# EAGLE design TinyISD1700_V2_2020-08-19-smd-sop-1206 (EAGLE 7.5.0)
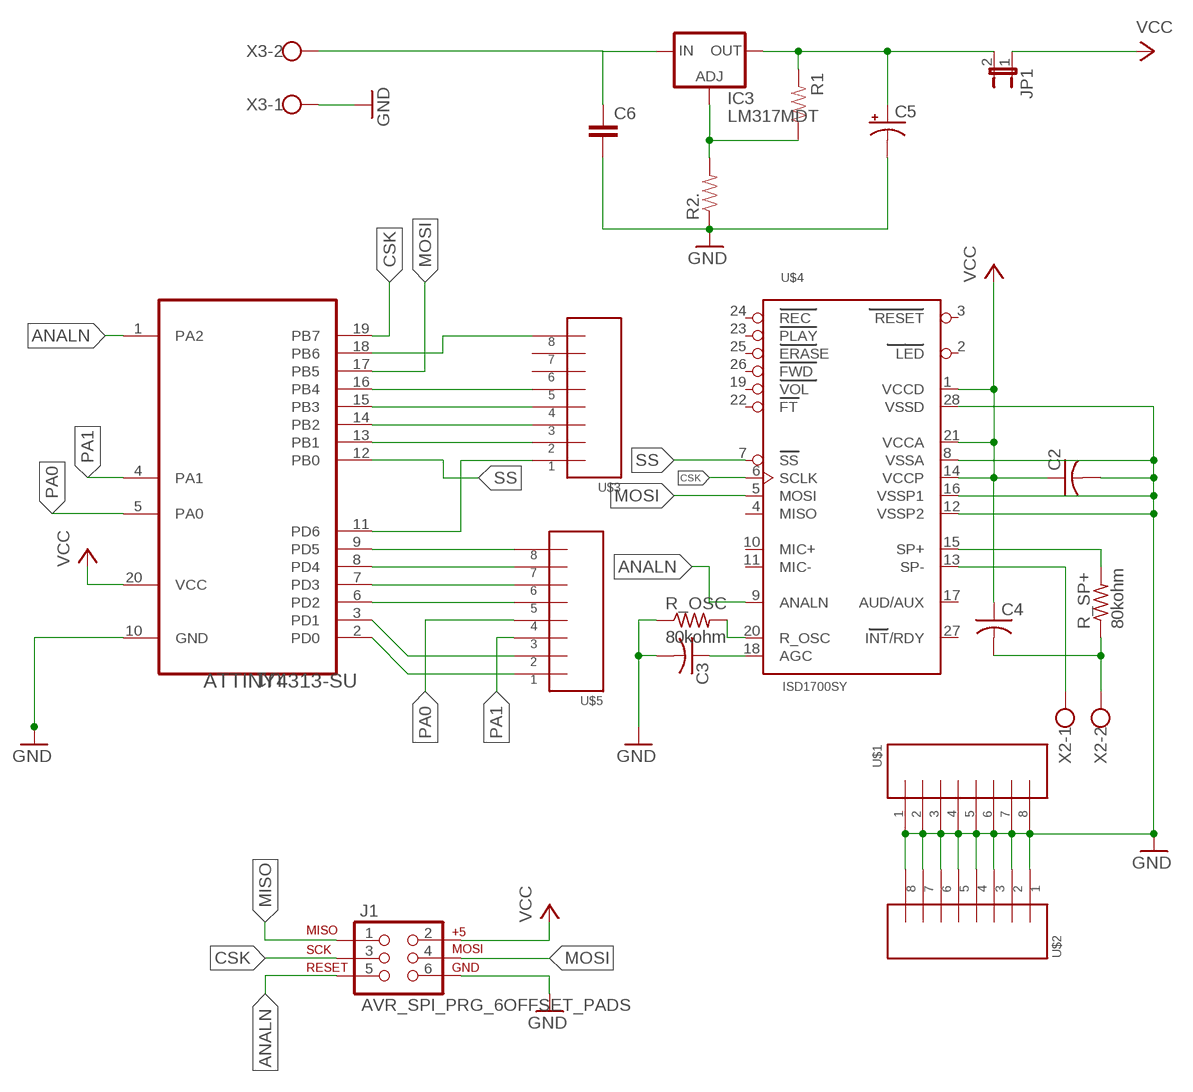
[diagram p0: schematic, sheet 1]

## Parts
C2  C-US050-030X075  [C050-030X075]
C3  C-US050-030X075  [C050-030X075]
C4  C-US050-030X075  [C050-030X075]
C5  CAP_POL1206  [EIA3216]
C6  CAP0805  [0805]
IC3  LM317MDT  [DPACK]
J1  AVR_SPI_PRG_6OFFSET_PADS  [2X3_OFFSET]
JP1  JP1E  [JP1]
R1  RESISTOR  [0805]
R2.  RESISTOR  [0805]
R_OSC  80kohm  R-US_0204/2V  [0204V]
R_SP+  80kohm  R-US_0204/2V  [0204V]
U1  ATTINY4313-SU  [SOIC127P1032X265-20N]
U$1  8PIN_HEADER  [8PIN_HEADER]
U$2  8PIN_HEADER  [8PIN_HEADER]
U$3  8PIN_HEADER  [8PIN_HEADER]
U$4  ISD1700SY  [SO28W]
U$5  8PIN_HEADER  [8PIN_HEADER]
X2  W237-102  [W237-102]
X3  W237-102  [W237-102]

## Nets
ANALN: J1.5 U1.1(PA2) U$4.9(ANALN)
CSK: J1.3 U1.19(PB7) U$4.6(SCLK)
GND: C2.2 C3.2 C5.C(-) C6.2 J1.6 R2..1 R_OSC.1 U1.10(GND) U$1.P$1 U$1.P$2 U$1.P$3 U$1.P$4 U$1.P$5 U$1.P$6 U$1.P$7 U$1.P$8 U$2.P$1 U$2.P$2 U$2.P$3 U$2.P$4 U$2.P$5 U$2.P$6 U$2.P$7 U$2.P$8 U$4.8(VSSA) U$4.12(VSSP2) U$4.16(VSSP1) U$4.28(VSSD) X3.1
MISO: J1.1
MOSI: J1.4 U1.17(PB5) U$4.5(MOSI)
N$1: R_OSC.2 U$4.20(R_OSC)
N$2: U1.13(PB1) U$3.P$2
N$3: U1.14(PB2) U$3.P$3
N$4: C4.2 R_SP+.1 X2.2
N$5: C3.1 U$4.18(AGC)
N$6: U$4.13(SP-) X2.1
N$7: R_SP+.2 U$4.15(SP+)
N$8: U1.15(PB3) U$3.P$4
N$9: U1.11(PD6) U$3.P$1
N$11: U1.9(PD5) U$5.P$8
N$12: U1.8(PD4) U$5.P$7
N$13: U1.7(PD3) U$5.P$6
N$14: U1.6(PD2) U$5.P$5
N$15: U1.3(PD1) U$5.P$2
N$16: U1.2(PD0) U$5.P$1
N$19: C5.A(+) IC3.4(OUT) JP1.2 R1.2
N$20: U1.16(PB4) U$3.P$5
N$28: C6.1 IC3.3(IN) X3.2
N$29: IC3.1(ADJ) R1.1 R2..2
PA0: U1.5(PA0) U$5.P$4
PA1: U1.4(PA1) U$5.P$3
Q: U1.18(PB6) U$3.P$8
SS: U1.12(PB0) U$4.7(SS)
VCC: C2.1 C4.1 J1.2 JP1.1 U1.20(VCC) U$4.1(VCCD) U$4.14(VCCP) U$4.21(VCCA)
Unconnected: U$3.P$6 U$3.P$7 U$4.2(LED) U$4.3(RESET) U$4.4(MISO) U$4.10(MIC+) U$4.11(MIC-) U$4.17(AUD/AUX) U$4.19(VOL) U$4.22(FT) U$4.23(PLAY) U$4.24(REC) U$4.25(ERASE) U$4.26(FWD) U$4.27(INT/RDY)

## Library data of the parts
C2-C4 = resistor:C-US: CAPACITOR, American symbol; OC_FARNELL: unknown
C5 = SparkFun2:CAP_POL: Capacitor Polarized These are standard SMD and PTH capacitors. Normally 10uF, 47uF, and 100uF in electrolytic and tantalum varieties. Always verify the external diameter of the through hole cap, it varies with capacity, voltage, and manufacturer. The EIA devices should be standard.
C6 = SparkFun2:CAP: Capacitor Standard 0603 ceramic capacitor, and 0.1" leaded capacitor.
IC3 = v-reg:LM317?*: 500 mA Adjustable Output Positive Voltage Regulator Source: http://www.onsemi.co.jp .. LM317M-D.PDF
J1 = SparkFun:AVR_SPI_PRG_6: AVR ISP 6 Pin This is the reduced ISP connector for AVR programming. Common on Arduino. This footprint will take up less PCB space and can be used with a 10-pin to 6-pin adapter such as SKU: BOB-08508; OC_FARNELL: unknown
JP1 = jumper:JP1E: JUMPER
R1 R2. = SparkFun:RESISTOR: Resistor Basic schematic elements and footprints for 0603, 1206, and PTH 1/10th watt (small) resistors.
R_OSC R_SP+ = rcl:R-US_: RESISTOR, American symbol; OC_FARNELL: unknown
U1 = Atmel_By_element14_Batch_1-00:ATTINY4313-SU: 8-bit Microcontroller with In-System Programmable Flash; MF: MICROCHIP; MPN: ATTINY4313-SU; OC_FARNELL: 1841621; OC_NEWARK: 12T1340; PACKAGE: SOIC-20; SUPPLIER: Atmel
U$1-U$3 U$5 = arduino:8PIN_HEADER; MF: RENESAS; MPN: YSDKS128E10; OC_FARNELL: 2946736
U$4 = isd-new-1:ISD1700; OC_FARNELL: unknown
X2 X3 = con-wago-500:W237-102: WAGO SCREW CLAMP; OC_FARNELL: unknown; OC_NEWARK: 70K9898

## Board
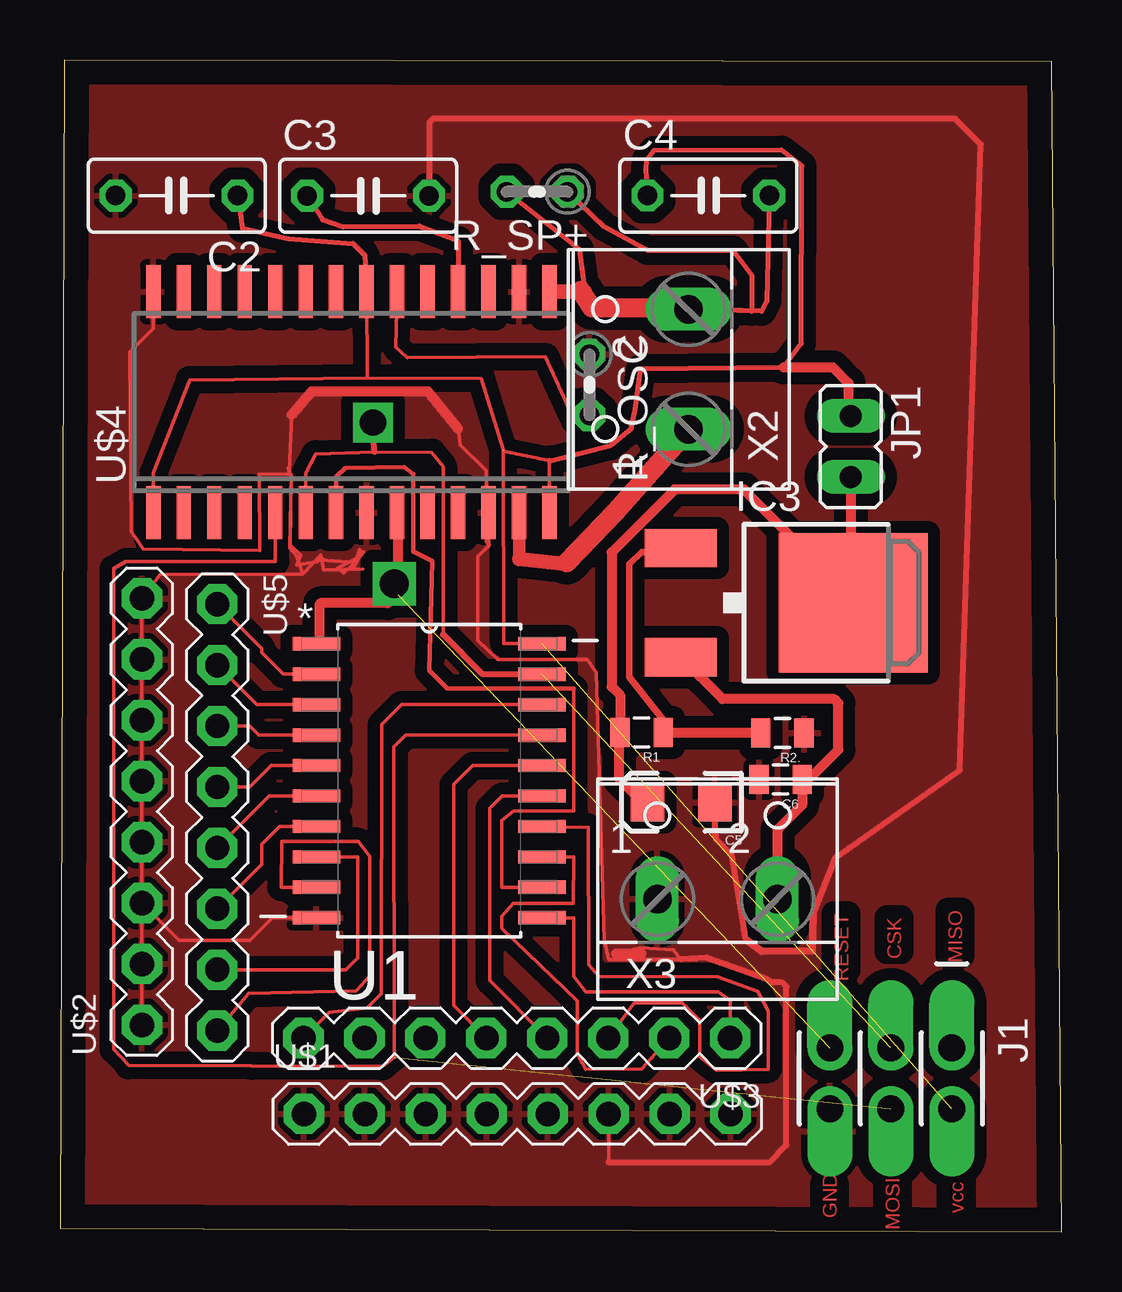
[diagram p1: board, top side]

Size 41.73 x 48.85 mm. Coordinates in mm from the lower left corner, seen from the top.
Outline: 0,0.15 41.73,0 41.33,48.79 0.18,48.85 0,0.15
Copper layers (1*16): Top 0.035mm / dielectric 1.5mm / Bottom 0.035mm
Design rules "default *": minimum track width 10mil, minimum drill 24mil, track to track 20mil, track to pad 20mil, pad to pad 20mil, via to via 20mil, smd to smd 8mil, copper to edge 40mil, drill to drill 8mil, minimum pad ring 10mil, minimum via ring 8mil, stop-mask expansion 4mil, vias tented up to drill 0mil, thermal gap 10mil

### Footprints (pad centres in the part's own frame; a part is rotated, then mirrored left to right if it is on the bottom)
C050-030X075 = drill 0.813 octagon: 1 -2.54,0; 2 2.54,0
EIA3216 = smd 1.4 x 1.6: A 1.4,0; C -1.4,0
0805 = smd 0.8 x 1.2: 1 -0.9,0; 2 0.9,0
DPACK = smd 1.6 x 3: 1 -2.28,-4.8; 3 2.28,-4.8 | smd 5.8 x 6.2: 4 0,2.38
2X3_OFFSET = drill 1.118 pad 1.88 offset: 1 -2.54,-1.27; 2 -2.54,1.27; 3 0,-1.27; 4 0,1.27; 5 2.54,-1.27; 6 2.54,1.27
JP1 = drill 0.914 long: 1 0,-1.27; 2 0,1.27
0204V = drill 0.813 octagon: 1 -1.27,0; 2 1.27,0
SOIC127P1032X265-20N = smd 1.981 x 0.559: 1 -4.699,5.715; 2 -4.699,4.445; 3 -4.699,3.175; 4 -4.699,1.905; 5 -4.699,0.635; 6 -4.699,-0.635; 7 -4.699,-1.905; 8 -4.699,-3.175; 9 -4.699,-4.445; 10 -4.699,-5.715; 11 4.699,-5.715; 12 4.699,-4.445; 13 4.699,-3.175; 14 4.699,-1.905; 15 4.699,-0.635; 16 4.699,0.635; 17 4.699,1.905; 18 4.699,3.175; 19 4.699,4.445; 20 4.699,5.715
8PIN_HEADER = drill 1.016 pad 1.676 octagon: P$1 0,0; P$2 2.54,0; P$3 5.08,0; P$4 7.62,0; P$5 10.16,0; P$6 12.7,0; P$7 15.24,0; P$8 17.78,0
SO28W = smd 0.6 x 2.2: 1 -8.255,-4.6; 2 -6.985,-4.6; 3 -5.715,-4.6; 4 -4.445,-4.6; 5 -3.175,-4.6; 6 -1.905,-4.6; 7 -0.635,-4.6; 8 0.635,-4.6; 9 1.905,-4.6; 10 3.175,-4.6; 11 4.445,-4.6; 12 5.715,-4.6; 13 6.985,-4.6; 14 8.255,-4.6; 15 8.255,4.6; 16 6.985,4.6; 17 5.715,4.6; 18 4.445,4.6; 19 3.175,4.6; 20 1.905,4.6; 21 0.635,4.6; 22 -0.635,4.6; 23 -1.905,4.6; 24 -3.175,4.6; 25 -4.445,4.6; 26 -5.715,4.6; 27 -6.985,4.6; 28 -8.255,4.6
W237-102 = drill 1.194 long: 1 -2.5,-1.27; 2 2.5,-1.27

### Placement (x,y rotation side)
C2  4.86,43.2 180 top
C3  12.84,43.2 0 top
C4  27.01,43.2 0 top
C5  25.88,17.91 180 top
C6  30.03,18.86 180 top
IC3  30.67,26.23 270 top
J1  34.62,6.4 180 top
JP1  32.95,32.74 180 top
R1  24.23,20.82 180 top
R2.  30.1,20.8 180 top
R_OSC  22.06,35.31 270 top
R_SP+  19.88,43.36 180 top
U1  15.38,18.81 0 top
U$1  10.16,4.92 0 top
U$2  3.41,8.63 90 top
U$3  27.92,8.08 180 top
U$4  12.14,34.59 0 top
U$5  6.55,26.17 270 top
X2  24.92,35.96 90 top
X3  27.39,15.15 0 top

### Tracks (layer width: path | path; a pad name or v marks a point on that pad's centre or on a via)
ANALN  (1 unrouted)
  Top 0.406: U$4.9 14.07,29.92 14.07,26.58 13.64,26.21 10.85,26.21 10.83,26.19 10.83,24.52 U1.1
CSK  (1 unrouted)
  Top 0.152: U$4.6 10.24,31.63 10.65,32.43 13.1,32.52 15.49,32.49 15.96,31.91 15.96,24.9
  Top 0.254: 15.96,24.9 17.59,23.27 20.07,23.27 U1.19 | 13.1,32.52 13.05,33.67
GND
  Top 0.152: U$4.28 3.89,37.65 2.9,36.66 2.96,29.19 3.46,28.46 8.33,28.4 8.3,31.6 9.63,31.56 9.58,28.5 9.86,28.18 10.12,27.42 | U$2.P$3 4.97,12.15 7.9,12.15 8.85,13.09 U1.10 | 23.17,11.6 24.23,11.84 25.56,11.77 25.87,11.37 22.87,11.37 22.68,12.16 22.34,23.32 21.97,23.86 18.23,23.86 17.4,24.65 17.4,28.15 17.86,28.6 U$4.12 | 12.61,27.64 11,27.59 10.86,28.22 10.12,27.42 | U$2.P$3 U$2.P$2 U$2.P$1 | U$2.P$3 U$2.P$4 U$2.P$5 U$2.P$6 U$2.P$7 U$2.P$8 4.18,27.39 10.12,27.42
  Top 0.154: 17.4,28.15 17.88,28.62 17.88,28.66 17.75,28.78 17.75,31.73 16.68,32.8 16.59,33.48 | 9.65,34.07 9.55,31.69 9.53,31.69 9.51,31.87 9.63,31.48 9.6,28.64 10.02,28.21 9.86,27.79 10.74,27.94 10.64,27.95 | 10.7,27.99 10.99,28.03 10.83,28.02 12.3,27.89 11.82,27.46 11.57,27.67 12.38,28.1 12.57,28.29 12.3,27.91 12.66,28.34 | 12.66,28.34 12.55,28.36 12.49,28.38 12.51,28.2 12.22,27.68 | 12.53,28.24 12.66,28.34 | 12.49,28.45 12.25,27.79 | U$1.P$6 22.86,2.92 22.85,2.91
  Top 0.254: C5.C 27.28,16.57 27.33,16.53 27.33,16.39 27.97,15.75 28.48,12.61 28.54,12.3 28.66,12.13 | 31.39,13.23 32.33,15.62 37.5,19.26 38.37,45.33 37.29,46.41 15.56,46.41 15.39,46.24 C3.2 | 22.85,2.91 29.55,2.91 30.27,3.63 30.27,10.22 30.1,10.39 29.7,10.39 29.48,10.53 26.92,11.43 25.87,11.37
  Top 0.305: 28.66,12.13 29.24,11.69 31.35,11.72 31.39,13.23
  Top 0.406: 23.17,11.6 24.24,11.6 | 16.59,33.48 15.33,35.03 10.47,35.04 9.65,34.07
  pour Top: 0.35,48.58 40.76,48.75 40.88,-0.09 0.15,0.4 0.32,7.24
MOSI  (1 unrouted)
  Top 0.152: U1.17 14.4,20.71 13.9,20.21 13.92,7.28 13.44,6.9 7.97,6.92 2.86,6.95 2.24,7.61 2.24,27.65 2.75,27.94 8.98,27.94 U$4.5
  Top 0.406: J1.4 34.63,5.13
N$1
  Top 0.152: 13.99,36.89 U$4.20
  Top 0.154: R_OSC.2 21.33,34.07 20.22,36.48 14.46,36.45 13.99,36.89
N$2
  Top 0.152: U$3.P$2 24.23,6.8 21.92,6.78 21.55,7.43 21.55,9.64 18.4,12.65 18.4,13.15 18.89,13.7 21.39,13.7 21.4,15.63 U1.13
N$3
  Top 0.152: U$3.P$3 23.93,9.56 25.92,9.56 26.65,8.81 26.66,7.3 27.36,6.74 29.51,6.78 29.52,9.21 29.08,10.03 27.4,10.63 22.44,10.66 22.04,11.13 22,16.87 U1.14
N$4
  Top 0.205: C4.2 29.46,38.8 29.26,38.42 29.24,38.38 X2.2 28.82,38.37 28.82,39.89 28.03,40.92 24.47,40.93 22.68,41.91 R_SP+.1
N$5
  Top 0.205: C3.1 10.94,42.19 11.78,41.9 14.97,41.93 16.59,41.31 U$4.18
N$6
  Top 0.513: 19.14,28.06 U$4.13
  Top 0.6: 20.88,27.87 19.14,28.06
  Top 0.613: 21.11,27.9 20.88,27.87
  Top 0.813: X2.1 26.07,33.33 23.16,30.02 21.11,27.9
N$7
  Top 0.205: R_SP+.2 21.64,40.96 21.85,39.19
  Top 0.6: U$4.15 21.85,39.19 21.69,39.24
  Top 0.813: 21.69,39.24 22.16,38.52 26.28,38.51
N$8
  Top 0.152: U$3.P$4 17.9,10.48 17.9,17.65 18.43,18.17 U1.15
N$9
  Top 0.152: U$3.P$1 27.92,9.65 27.43,10.01 21.91,10.01 21.4,10.65 21.4,13.09 U1.11
N$10  (via drill 1.2)
  other vias: 13.93,27.02
N$11
  Top 0.152: U$5.P$8 7.87,9.96 12.33,10.05 12.9,10.68 12.9,15.65 12.43,16.28 9.24,16.28 9.22,14.36 U1.9
N$12
  Top 0.152: U$5.P$7 11.9,10.93 12.4,11.43 12.4,15.63 U1.8
N$13
  Top 0.152: U$5.P$6 8.4,15.32 8.4,16.15 9.16,16.9 U1.7
N$14
  Top 0.152: U$5.P$5 8.72,18.17 U1.6
N$15
  Top 0.152: U$5.P$2 8.2,21.98 U1.3
N$16
  Top 0.152: U$5.P$1 8.4,24.32 8.4,24.15 9.3,23.25 U1.2
N$18  (via drill 1.1)
  other vias: 13.04,33.74
N$19
  Top 0.406: C5.A 24.28,17.91 23.31,18.89 23.31,20.8 R1.2 23.33,22.38 22.98,22.73 22.98,28.33 25.61,30.96 28.49,30.96 32.95,26.5 | JP1.2 32.95,26.5 | IC3.4 32.95,26.33 32.95,26.5
N$20
  Top 0.152: U$3.P$5 16.4,9.44 16.4,18.65 17.2,19.44 U1.16
N$28
  Top 0.406: X3.2 29.9,14.54 29.9,16.77 30.92,17.79 C6.1 30.84,18.94 31.27,18.94 32.43,20.1 32.43,22.03 32.25,22.21 27.61,22.21 IC3.3
N$29
  Top 0.28: R1.1 25.13,21.34 23.71,23.14 23.73,27.83 24.25,28.35 25.71,28.35 IC3.1
  Top 0.406: R2..2 25.16,20.8 R1.1
PA0
  Top 0.152: U$5.P$4 7.9,18.55 8.8,19.44 U1.5
PA1
  Top 0.152: U$5.P$3 7.9,21.09 8.28,20.71 U1.4
Q
  Top 0.152: U$3.P$8 11.21,9.15 12.8,9.34 13.38,9.93 13.4,21.15 14.24,21.98 U1.18
SS
  Top 0.152: U1.12 18.4,14.36 18.4,17.15 18.91,17.54 21.41,17.54 21.4,22.65
  Top 0.19: U$4.7 11.51,31.5 11.89,31.85 14.35,31.88 14.72,31.6 14.72,28.37 15.51,27.97 15.37,23.41 16.13,22.65 21.4,22.65
VCC  (2 unrouted)
  Top 0: 18.45,32.57 18.44,32.62 18.44,32.57
  Top 0.152: 20.39,32.14 U$4.14 | U$4.1 3.89,31.63 5.4,35.52 12.81,35.58 U$4.21 | U1.20 18.49,24.53 18.47,32.6
  Top 0.154: 20.38,32.16 18.54,32.53 18.47,32.6 17.55,35.57 12.81,35.58
  Top 0.205: C4.1 24.4,44.27 24.43,44.68 24.74,45.07 30.07,45.1 30.91,44.44 30.89,37.05 30.15,36.04 24.2,35.98 23.96,34.29 23.8,33.49 22.93,32.79 20.39,32.14 20.4,32.17 20.38,32.16 | C2.1 7.6,41.84 9.51,41.4 12.21,41.2 12.69,40.73 U$4.21
  Top 0.406: 30.15,36.04 32.2,36.04 32.85,35.39 32.85,34.11 JP1.1

### Text on the board
Top: RESET | MISO | CSK | MOSI | vcc | GND